# Altium schematic sheet High Voltage.SchDoc
size Tabloid; SheetNumber: 2; SheetTotal: 5
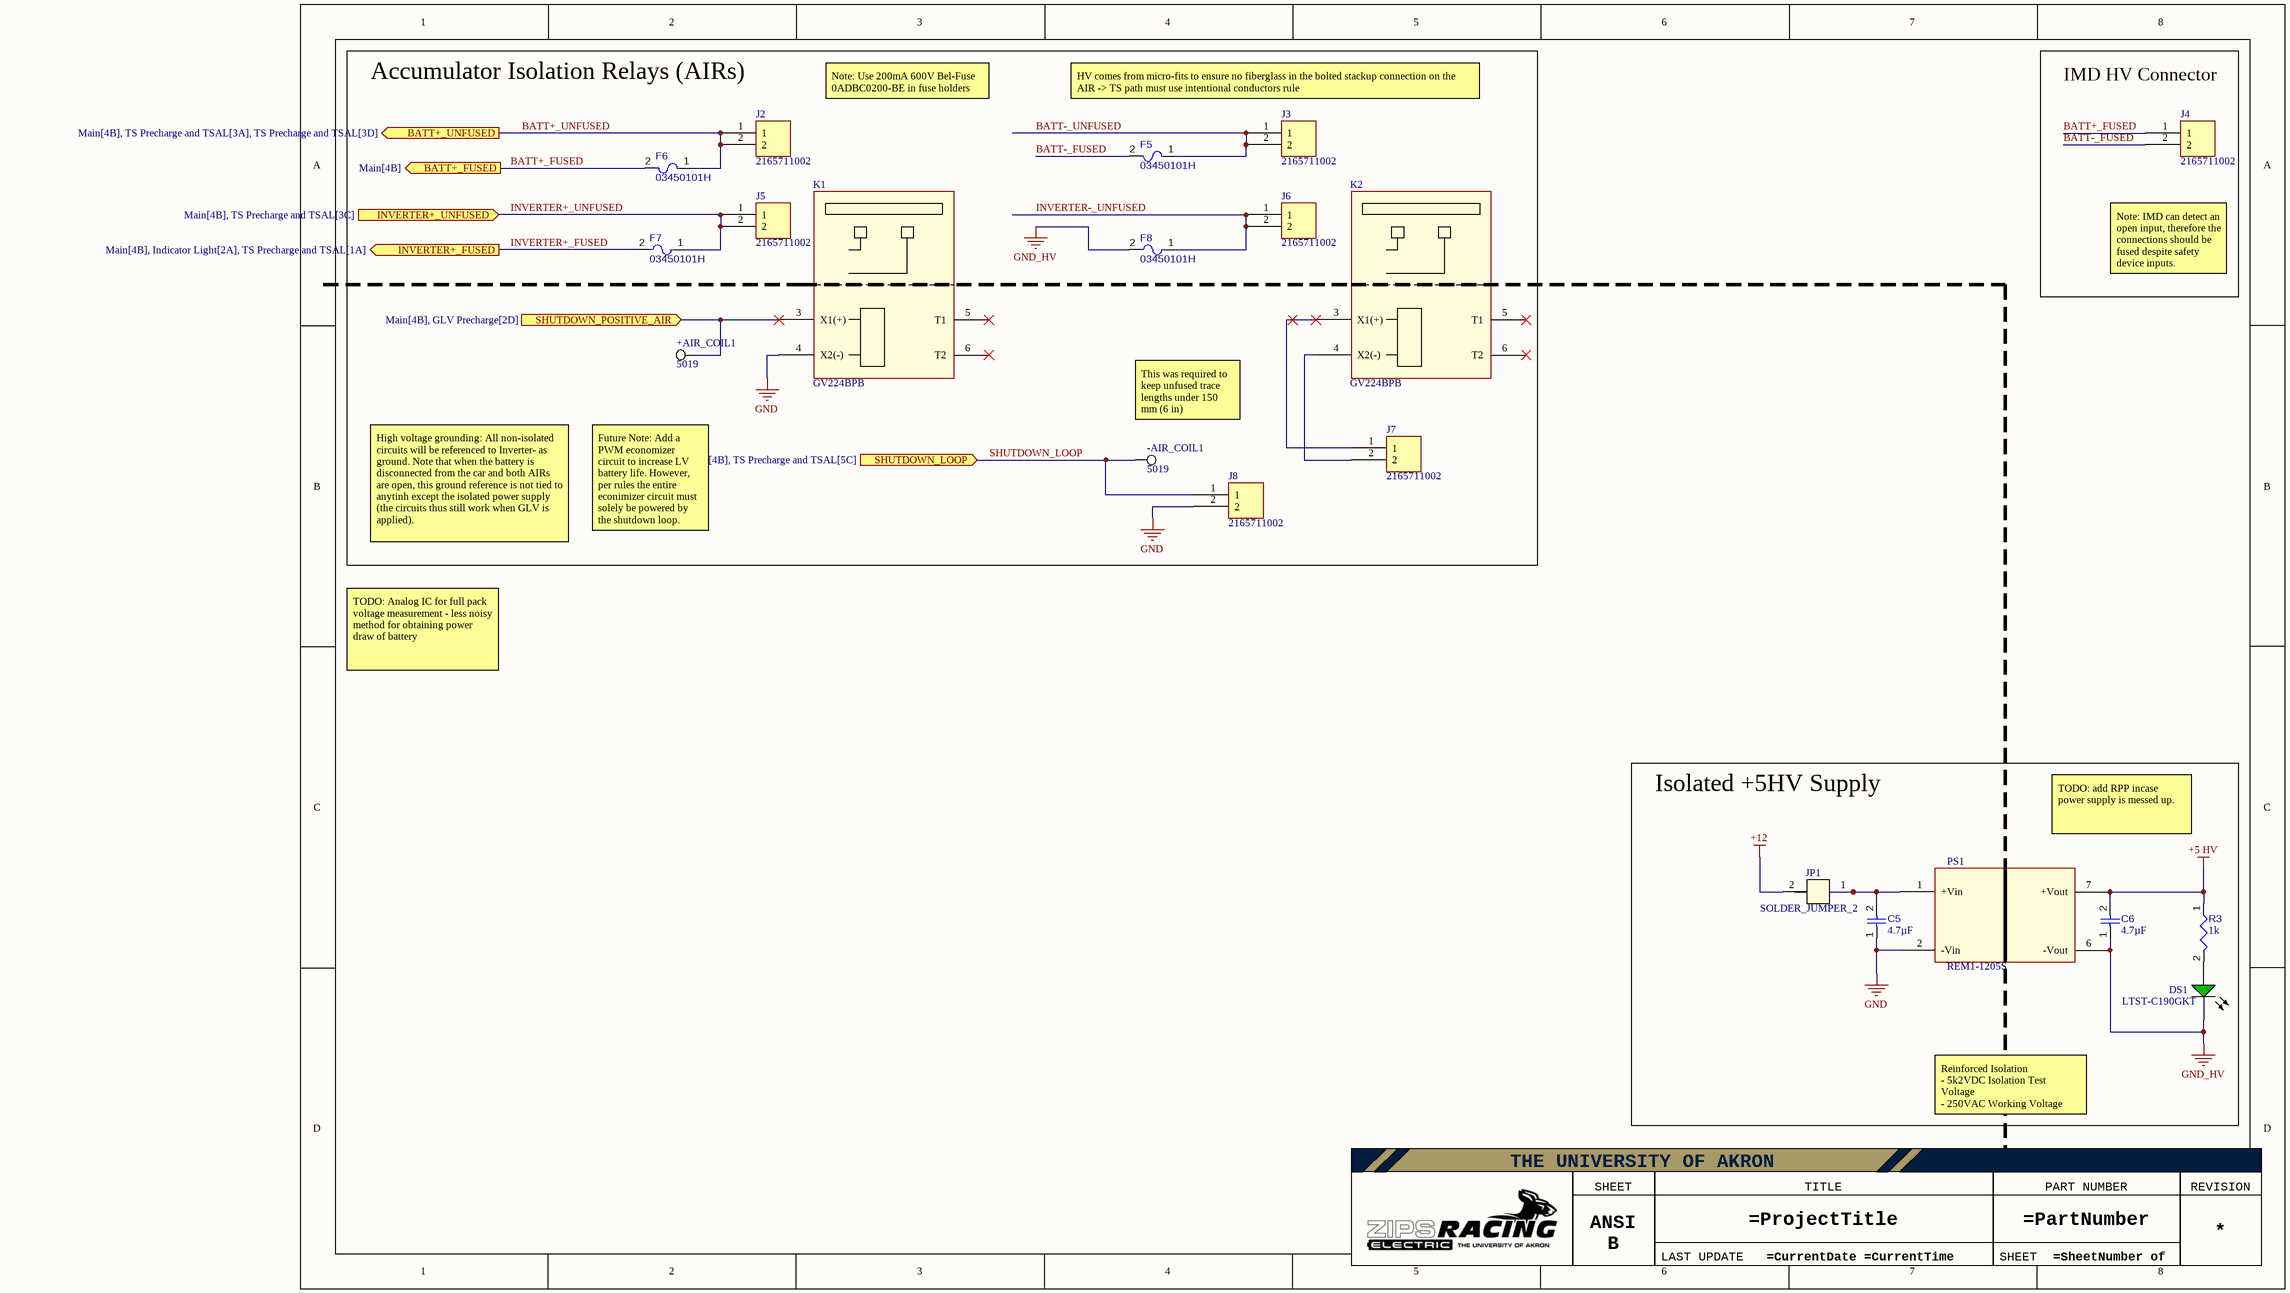
[diagram p0: High Voltage.SchDoc]

## Parts
+AIR_COIL1  5019  [KSTN-5019_V]
-AIR_COIL1  5019  [KSTN-5019_V]
C5  value 4.7µF  [CAPC0805(2012)145_L]  (hidden comment: Capacitor 4.7µF +/-40% 25V 0805)
C6  value 4.7µF  [CAPC0805(2012)145_L]  (hidden comment: Capacitor 4.7µF +/-40% 25V 0805)
DS1  LTST-C190GKT  [LTST-C190GKT_V]
F5  03450101H  [03450101H-Footprint-1]
F6  03450101H  [03450101H-Footprint-1]
F7  03450101H  [03450101H-Footprint-1]
F8  03450101H  [03450101H-Footprint-1]
J2  2165711002  [FP-216571-1002-MFG]
J3  2165711002  [FP-216571-1002-MFG]
J4  2165711002  [FP-216571-1002-MFG]
J5  2165711002  [FP-216571-1002-MFG]
J6  2165711002  [FP-216571-1002-MFG]
J7  2165711002  [FP-216571-1002-MFG]
J8  2165711002  [FP-216571-1002-MFG]
JP1  SOLDER_JUMPER_2  [C0603_JUMPER]  (no BOM)
K1  GV224BPB  [GV225BPX-Footprint-1]
K2  GV224BPB  [GV225BPX-Footprint-1]
PS1  REM1-1205S  [REM1-1205S-Footprint-1]
R3  value 1k  [RESC1608X55X25ML10T15]  (hidden comment: Resistor 1k +/-1% 0603 100 mW)

## Blocks framed on the sheet
Accumulator Isolation Relays (AIRs): +AIR_COIL1 -AIR_COIL1 F5-F8 J2 J3 J5-J8 K1 K2
IMD HV Connector: J4
Isolated +5HV Supply: C5 C6 DS1 JP1 PS1 R3

## Ports
BATT+_FUSED (out, see Main[4B]), BATT+_UNFUSED (out, see Main[4B], TS Precharge and TSAL[3A], TS Precharge and TSAL[3D]), INVERTER+_FUSED (out, see Main[4B], Indicator Light[2A], TS Precharge and TSAL[1A]), INVERTER+_UNFUSED (in, see Main[4B], TS Precharge and TSAL[3C]), SHUTDOWN_LOOP (in, see Main[4B], TS Precharge and TSAL[5C]), SHUTDOWN_POSITIVE_AIR (in, see Main[4B], GLV Precharge[2D])

## Nets
+5 HV: C6.2 PS1.7(+Vout) R3.1
+12: JP1.2
GND: C5.1 J8.2 K1.4(X2(-)) PS1.2(-Vin)
GND_HV: C6.1 DS1.2(K) F8.2 PS1.6(-Vout)
BATT+_FUSED: F6.2 J4.1 ; port BATT+_FUSED
BATT+_UNFUSED: F6.1 J2.1 J2.2 ; port BATT+_UNFUSED
BATT-_FUSED: F5.2 J4.2
BATT-_UNFUSED: F5.1 J3.1 J3.2
INVERTER+_FUSED: F7.2 ; port INVERTER+_FUSED
INVERTER+_UNFUSED: F7.1 J5.1 J5.2 ; port INVERTER+_UNFUSED
INVERTER-_UNFUSED: F8.1 J6.1 J6.2
SHUTDOWN_LOOP: -AIR_COIL1.1 J8.1 ; port SHUTDOWN_LOOP
SHUTDOWN_POSITIVE_AIR: +AIR_COIL1.1 K1.3(X1(+)) ; port SHUTDOWN_POSITIVE_AIR
NetC5_2: C5.2 JP1.1 PS1.1(+Vin)
NetDS1_1: DS1.1(A) R3.2
NetJ7_1: J7.1 K2.3(X1(+))
NetJ7_2: J7.2 K2.4(X2(-))

Not connected (* = marked no-connect by the designer): K1 5(T1)* 6(T2)*; K2 5(T1)* 6(T2)*; PS1 3(NC) 4(NC) 5(NC)

## Notes on the sheet
- Note: Use 200mA 600V Bel-Fuse 0ADBC0200-BE in fuse holders
- (near J3) HV comes from micro-fits to ensure no fiberglass in the bolted stackup connection on the AIR -> TS path must use intentional conductors rule
- Note: IMD can detect an open input, therefore the connections should be fused despite safety device inputs.
- (near -AIR_COIL1) This was required to keep unfused trace lengths under 150 mm (6 in)
- High voltage grounding: All non-isolated circuits will be referenced to Inverter- as ground. Note that when the battery is disconnected from the car and both AIRs are open, this ground reference is not tied to anytinh except the isolated power supply (the circuits thus still work when GLV is applied).
- Future Note: Add a PWM economizer circuit to increase LV battery life. However, per rules the entire econimizer circuit must solely be powered by the shutdown loop.
- TODO: Analog IC for full pack voltage measurement - less noisy method for obtaining power draw of battery
- TODO: add RPP incase power supply is messed up.
- Reinforced Isolation
  - 5k2VDC Isolation Test Voltage
  - 250VAC Working Voltage
- THE UNIVERSITY OF AKRON
- SHEET SIZE
- TITLE
- PART NUMBER
- REVISION
- ANSI B
- LAST UPDATE
- SHEET

## Library data of the parts
+AIR_COIL1 -AIR_COIL1 = CMP-00012-1: Interconnection Device
C5 C6 = CMP-001-00080-4: Chip Capacitor, 4.7µF +/-40%, 25V, 0805, Thickness 1.45 mm; Tolerance: 20%; Voltage Rating: 25V; Min Operating Temperature: -55°C; Max Operating Temperature: 85°C; Pins: 2; Mounting Technology: SMT; Case/Package: 0805
DS1 = CMP-007-00022-2: LED Uni-Color Green, 100 mW, 30 mA, -55 to 85 degC, 2-Pin SMD, RoHS, Tape and Reel; Manufacturer: Lite-On; Power: 100mW; Forward Voltage: 2.1V; Viewing Angle: 130degrees; Forward Current: 20mA; Luminous Intensity: 6mcd; Lens Style: Clear; Manufacturer URL: http://www.us.liteon.com/; RoHS Compliant: True; Colour: Green; Package Description: 2-Pin Surface Mount Device, Body 1.6 x 0.8 mm; Datasheet URL: http://datasheet.octopart.com/LTST-C190GKT-Lite-On-datasheet-158530.pdf; Datasheet Version: Dec-06; Mounting Technology: SM; Case/Package: 0603; Package Reference: C190GKT; Packaging: TapeandReel; Min Operating Temperature: -55°C; Nominal Vf: 2.1V; Package Quantity: 3000; Illumination Colour: Green; Max Operating Temperature: 85°C; Pins: 2
F5-F8 = CMP-005-00013-2: Littelfuse 3AG 600VDC Fuse Holder; Voltage Rating: 600V; Mounting Technology: Through-Hole; Max Operating Temperature: -40°C; Pins: 2; Min Operating Temperature: 85°C; ComponentLink1Description: Datasheet; ComponentLink1URL: https://m.littelfuse.com/~/media/electronics/datasheets/fuse_holders/littelfuse_fuse_holder_345_hv_datasheet.pdf.pdf
J2-J8 = CMP-002-00115-1: Micro-Fit+ Vertical Header, Through Hole, 3.00mm Pitch, Single Row, 2 Circuits, Matte Tin (Sn) Plating, Glow-Wire Capable, Black; Max Current Rating: 12.5A; Voltage Rating: 600V; Gender: Male; Rows: 1; Connector Type: PCB Header; Min Operating Temperature: -40°C; Pins: 2; ComponentLink1Description: Datasheet; ComponentLink1URL: https://www.molex.com/en-us/products/part-detail/2165711002?display=pdf; Mounting Technology: Thru-hole; Max Operating Temperature: 105°C
JP1 = CMP-023-000020-4: 2 position solder jumper, no BOM; Source: Zips_Racing_Electric.SchLib; Design Item ID: SOLDER_JUMPER_2
K1 K2 = CMP-008-00008-5: Contactors - Electromechanical CONTACTOR; Contact Form: SPST-NO; Rated Cycles: 1,000,000; Coil Current: 0.68A; Max Supply Voltage: 800V; Coil Voltage Nominal: 12V; Max Coil Voltage: 16V; Min Operating Temperature: -55°C; Pins: 4; Mounting Technology: PCB Mount; Max Operating Temperature: 85°C
PS1 = CMP-019-00059-2: DC-DC Unregulated Power Supply Module, 1 Output, 1W, Hybrid; Throw Configuration: DC-DC UNREGULATED POWER SUPPLY MODULE; RoHS Compliant: Yes; Reach SVHC Compliant: Yes
R3 = CMP-009-00014-5: Chip Resistor, 1 KOhm, +/-1%, 0.1 W, -55 to 155 degC, 0603 (1608 Metric); Voltage Rating: 50V; Power: 100mW; Tolerance: 1%; Mounting Technology: SM; Pins: 2; Case/Package: 0603; Min Operating Temperature: -55°C; RoHS Compliant: True; Max Operating Temperature: 155°C